# EAGLE design Famicon_IO_Jack_Spacer (EAGLE 9.1.3)
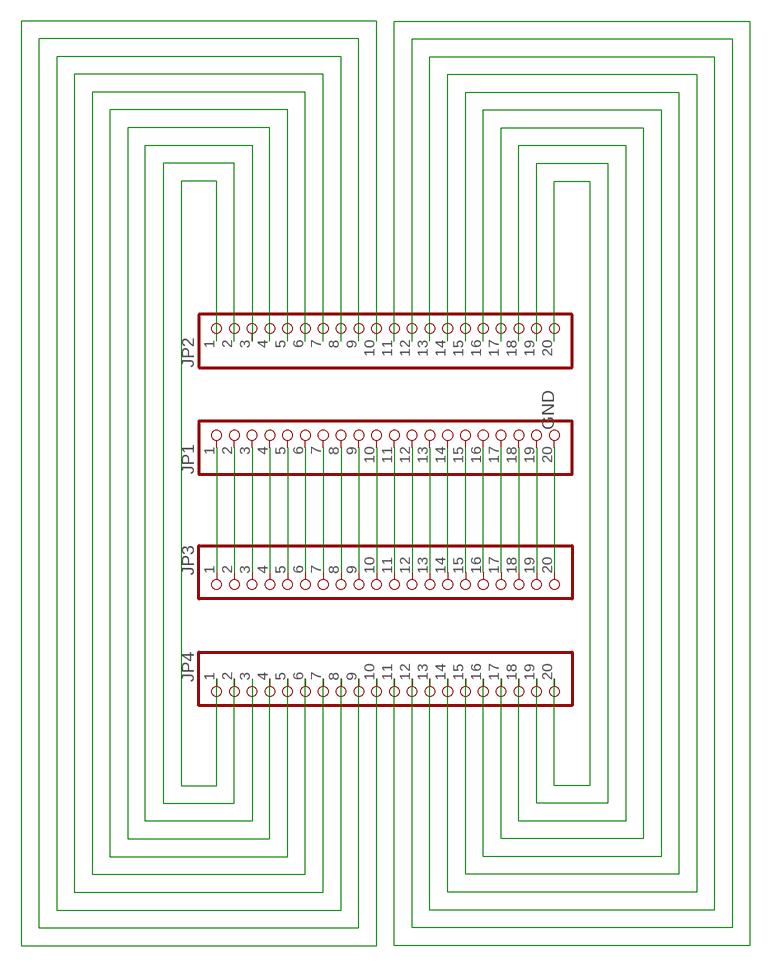
[diagram p0: schematic, sheet 1]

## Parts
JP1  PINHD-1X20_2.54-S  [1X20-S]
JP2  PINHD-1X20_2.54-S  [1X20-S]
JP3  PINHD-1X20_2.54-S  [1X20-S]
JP4  PINHD-1X20_2.54-S  [1X20-S]

## Nets
GND: JP1.20 JP3.20
N$1: JP1.1 JP3.1
N$2: JP1.2 JP3.2
N$3: JP1.3 JP3.3
N$4: JP1.4 JP3.4
N$5: JP1.5 JP3.5
N$6: JP1.6 JP3.6
N$7: JP1.7 JP3.7
N$8: JP1.8 JP3.8
N$9: JP1.9 JP3.9
N$10: JP1.10 JP3.10
N$11: JP1.11 JP3.11
N$12: JP1.12 JP3.12
N$13: JP1.13 JP3.13
N$14: JP1.14 JP3.14
N$15: JP1.15 JP3.15
N$16: JP1.16 JP3.16
N$17: JP1.17 JP3.17
N$18: JP1.18 JP3.18
N$19: JP1.19 JP3.19
N$21: JP2.20 JP4.20
N$22: JP2.19 JP4.19
N$23: JP2.18 JP4.18
N$24: JP2.17 JP4.17
N$25: JP2.16 JP4.16
N$26: JP2.15 JP4.15
N$27: JP2.1 JP4.1
N$28: JP2.2 JP4.2
N$29: JP2.3 JP4.3
N$30: JP2.4 JP4.4
N$31: JP2.5 JP4.5
N$32: JP2.6 JP4.6
N$33: JP2.14 JP4.14
N$34: JP2.7 JP4.7
N$35: JP2.13 JP4.13
N$36: JP2.12 JP4.12
N$37: JP2.8 JP4.8
N$38: JP2.9 JP4.9
N$39: JP2.11 JP4.11
N$40: JP2.10 JP4.10

## Library data of the parts
JP1-JP4 = pinhead-2:PINHD-1X20: PIN HEADER

## Board
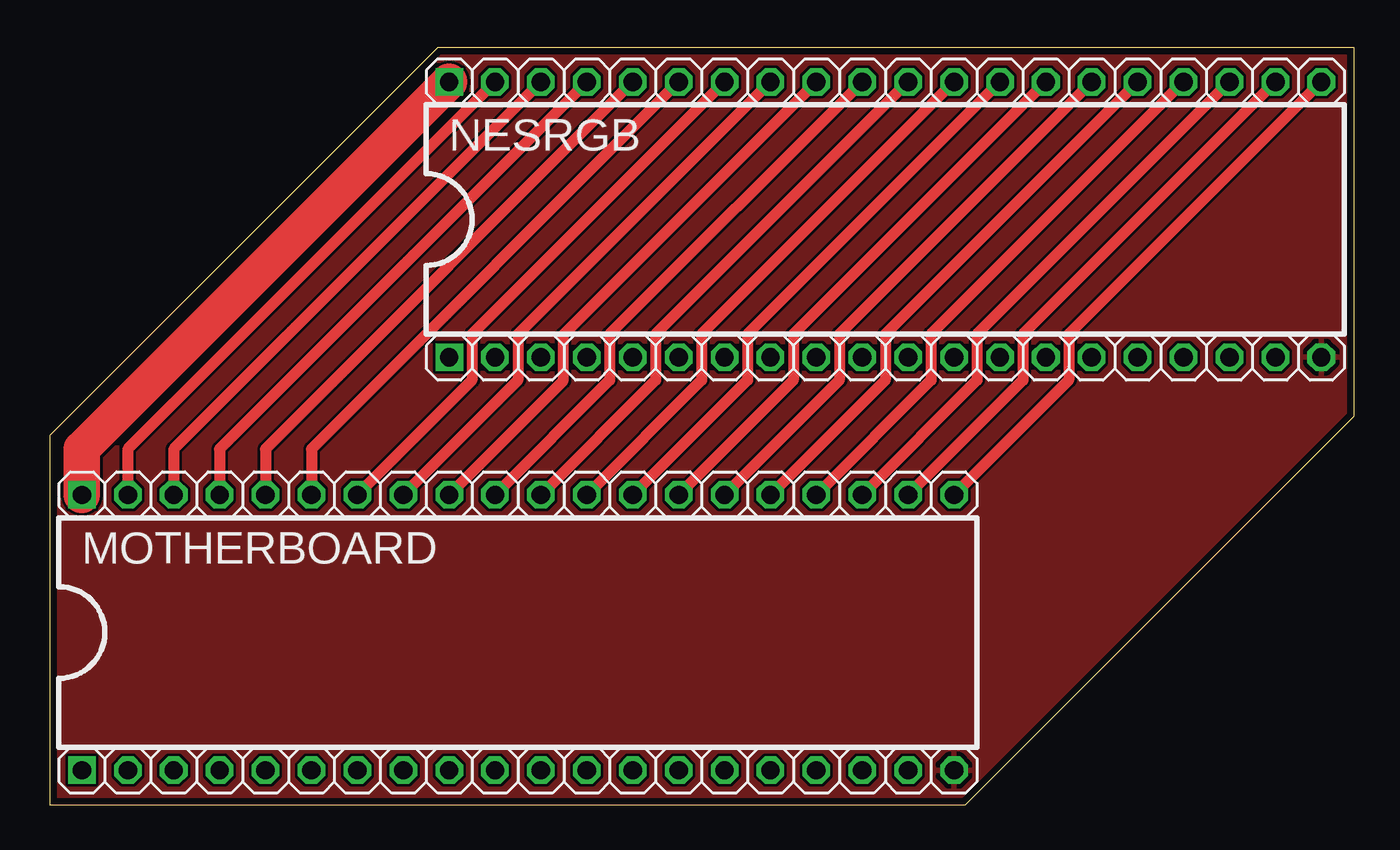
[diagram p1: board, top side]
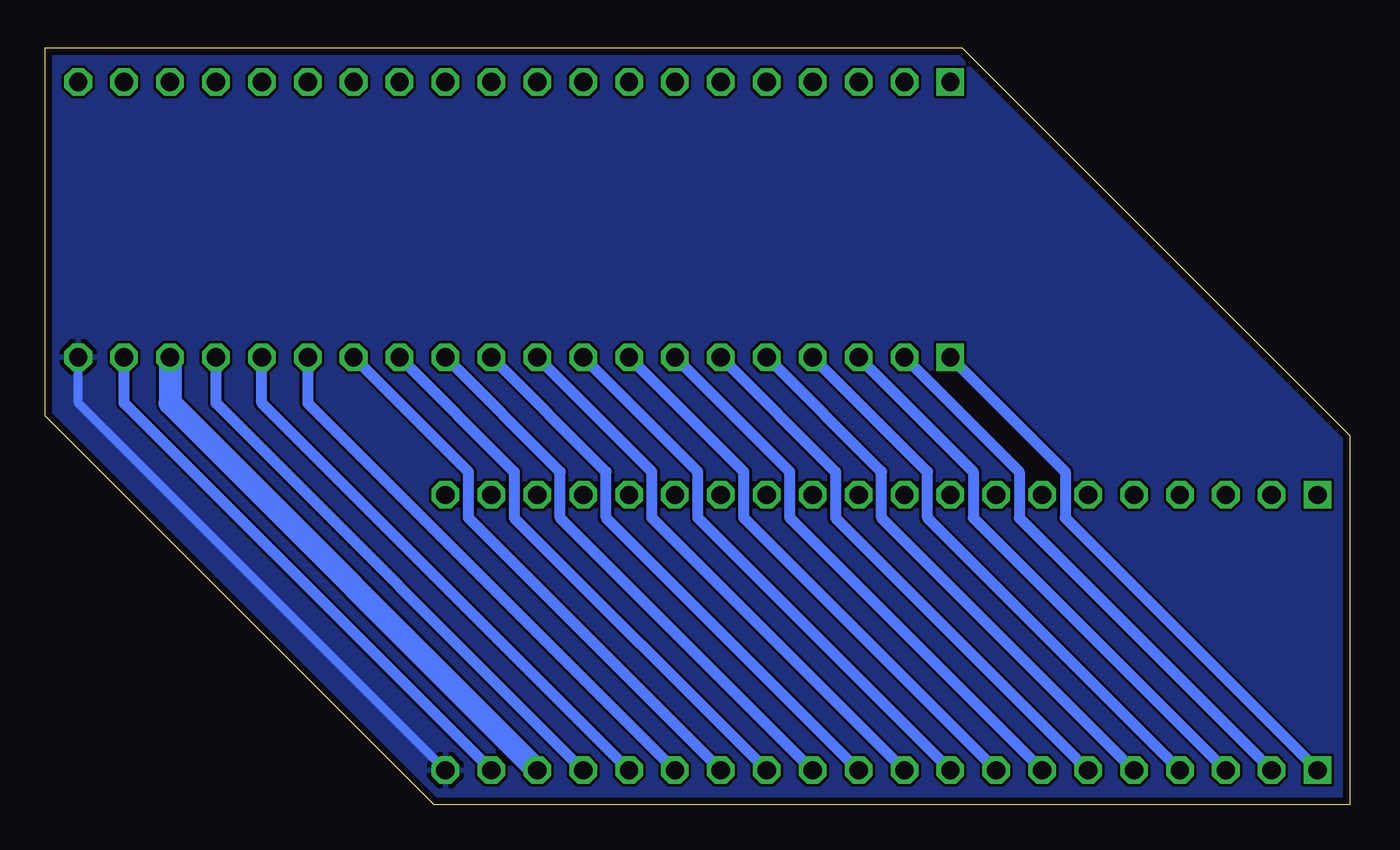
[diagram p2: board, bottom side, seen from below]

Size 72.19 x 41.9 mm. Coordinates in mm from the lower left corner, seen from the top.
Outline: 0,0 50.67,0 72.19,21.51 72.19,41.9 21.45,41.9 0,20.45 0,0
Copper layers (1*16): Top 0.035559375mm / dielectric 1.6mm / Bottom 0.035559375mm
Design rules "oshpark-2layer": minimum track width 6mil, minimum drill 10mil, track to track 6mil, track to pad 6mil, pad to pad 6mil, via to via 6mil, smd to smd 6mil, copper to edge 15mil, drill to drill 6mil, minimum pad ring 5mil, minimum via ring 5mil, stop-mask expansion 2.5mil, vias tented up to drill 0mil, thermal gap 10mil

### Footprints (pad centres in the part's own frame; a part is rotated, then mirrored left to right if it is on the bottom)
1X20-S = drill 1.016 square: 1 -24.13,0 | drill 1.016 octagon: 2 -21.59,0; 3 -19.05,0; 4 -16.51,0; 5 -13.97,0; 6 -11.43,0; 7 -8.89,0; 8 -6.35,0; 9 -3.81,0; 10 -1.27,0; 11 1.27,0; 12 3.81,0; 13 6.35,0; 14 8.89,0; 15 11.43,0; 16 13.97,0; 17 16.51,0; 18 19.05,0; 19 21.59,0; 20 24.13,0

### Placement (x,y rotation side)
JP1  25.91,1.91 0 top
JP2  25.91,17.15 0 top
JP3  46.23,24.77 0 top
JP4  46.23,40 0 top

### Tracks (layer width: path | path; a pad name or v marks a point on that pad's centre or on a via)
GND
  Bottom 0.508: JP1.20 70.36,22.23 JP3.20
  pour Top: -0.76,43.81 -0.76,-0.64 70.36,-0.64 75.44,-0.64 75.44,45.09 -0.76,45.09
  pour Bottom: -0.76,45.09 -0.76,-0.64 75.44,-0.64 75.44,45.09
N$1
  Bottom 0.61: JP1.1 15.75,15.88 15.75,18.42 JP3.1
N$2
  Bottom 0.61: JP1.2 18.29,15.88 18.29,18.42 JP3.2
N$3
  Bottom 0.61: JP1.3 20.83,15.88 20.83,18.42 JP3.3
N$4
  Bottom 0.61: JP1.4 23.37,15.88 23.37,18.42 JP3.4
N$5
  Bottom 0.61: JP1.5 25.91,15.88 25.91,18.42 JP3.5
N$6
  Bottom 0.61: JP3.6 28.45,18.42 28.45,15.88 JP1.6
N$7
  Bottom 0.61: JP1.7 30.99,15.88 30.99,18.42 JP3.7
N$8
  Bottom 0.61: JP1.8 33.53,15.88 33.53,18.42 JP3.8
N$9
  Bottom 0.61: JP1.9 36.07,15.88 36.07,18.42 JP3.9
N$10
  Bottom 0.61: JP1.10 38.61,15.88 38.61,18.42 JP3.10
N$11
  Bottom 0.61: JP1.11 41.15,15.88 41.15,18.42 JP3.11
N$12
  Bottom 0.61: JP1.12 43.69,15.88 43.69,18.42 JP3.12
N$13
  Bottom 0.61: JP3.13 46.23,18.42 46.23,15.88 JP1.13
N$14
  Bottom 0.61: JP1.14 48.77,15.88 48.77,18.42 JP3.14
N$15
  Bottom 0.61: JP3.15 57.66,22.23 JP1.15
N$16
  Bottom 0.61: JP1.16 60.2,22.23 JP3.16
N$17
  Bottom 0.61: JP1.17 62.74,22.23 JP3.17
N$18
  Bottom 1.27: JP1.18 65.28,22.23 JP3.18
N$19
  Bottom 0.61: JP1.19 67.82,22.23 JP3.19
N$21
  Top 0.61: JP2.20 56.39,23.5 56.39,26.04 JP4.20
N$22
  Top 0.61: JP2.19 53.85,23.5 53.85,26.04 JP4.19
N$23
  Top 0.61: JP2.18 51.31,23.5 51.31,26.04 JP4.18
N$24
  Top 0.61: JP2.17 48.77,23.5 48.77,26.04 JP4.17
N$25
  Top 0.61: JP2.16 46.23,23.5 46.23,26.04 JP4.16
N$26
  Top 0.61: JP2.15 43.69,23.5 43.69,26.04 JP4.15
N$27
  Top 2.032: JP4.1 1.78,19.69 JP2.1
N$28
  Top 0.61: JP4.2 4.32,19.69 JP2.2
N$29
  Top 0.61: JP4.3 6.86,19.69 JP2.3
N$30
  Top 0.61: JP4.4 9.4,19.69 JP2.4
N$31
  Top 0.61: JP4.5 11.94,19.69 JP2.5
N$32
  Top 0.61: JP4.6 14.48,19.69 JP2.6
N$33
  Top 0.61: JP2.14 41.15,23.5 41.15,26.04 JP4.14
N$34
  Top 0.61: JP2.7 23.37,23.5 23.37,26.04 JP4.7
N$35
  Top 0.61: JP2.13 38.61,23.5 38.61,26.04 JP4.13
N$36
  Top 0.61: JP2.12 36.07,23.5 36.07,26.04 JP4.12
N$37
  Top 0.61: JP2.8 25.91,23.5 25.91,26.04 JP4.8
N$38
  Top 0.61: JP2.9 28.4,23.44 28.4,25.98 JP4.9
N$39
  Top 0.61: JP2.11 33.53,23.5 33.53,26.04 JP4.11
N$40
  Top 0.61: JP2.10 30.99,23.5 30.99,26.04 JP4.10

### Text on the board
tPlace: NESRGB | MOTHERBOARD